# Altium project ESP32 HUST 01.PrjPcb
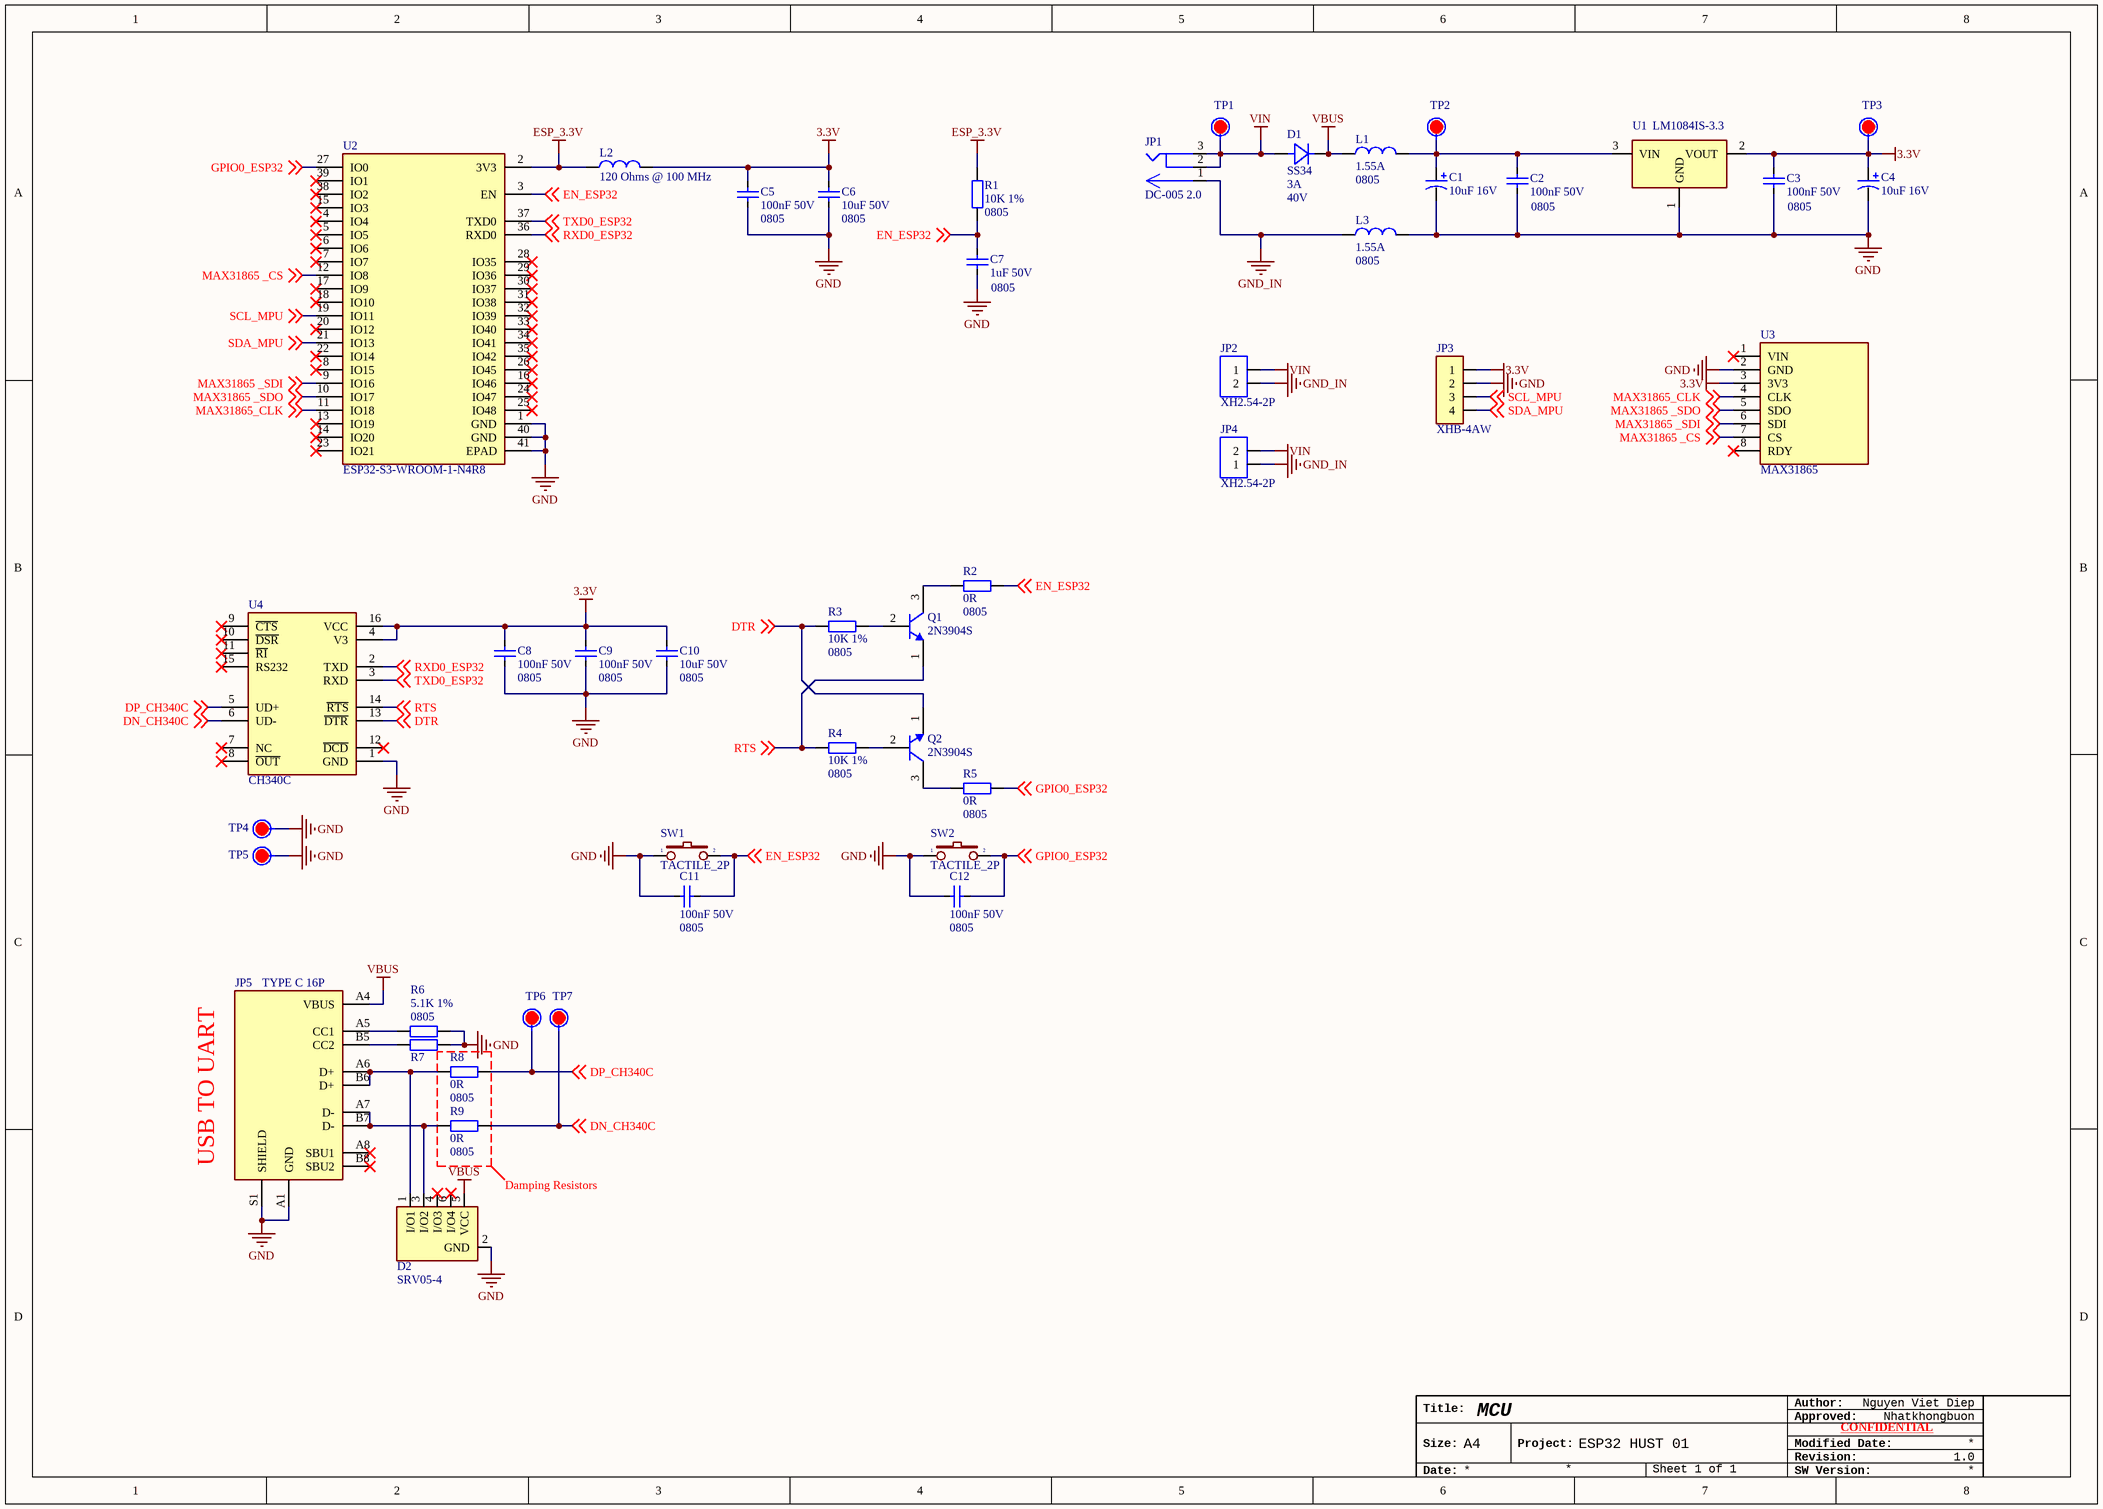
[diagram p0: MCU.SchDoc]
1 sheet, 46 parts. Net scope: global (net labels, ports and power ports of the same name join across sheets).
Board file: PCB.PcbDoc

## Sheet MCU.SchDoc: MCU
size A3; ApprovedBy: Nhatkhongbuon; Author: Nguyen Viet Diep; Revision: 1.0; SheetNumber: 1; SheetTotal: 1; ProjectTitle: ESP32 HUST 01

### Parts
C1  10uF 16V  [CAP-ALU-SMD-B -NEW]
C2  100nF 50V  Size: 0805  [CAP_SMD_0805_NEW]
C3  100nF 50V  Size: 0805  [CAP_SMD_0805_NEW]
C4  10uF 16V  [CAP-ALU-SMD-B -NEW]
C5  100nF 50V  Size: 0805  [CAP_SMD_0805_NEW]
C6  10uF 50V  Size: 0805  [CAP_SMD_0805_NEW]
C7  1uF 50V  Size: 0805  [CAP_SMD_0805_NEW]
C8  100nF 50V  Size: 0805  [CAP_SMD_0805_NEW]
C9  100nF 50V  Size: 0805  [CAP_SMD_0805_NEW]
C10  10uF 50V  Size: 0805  [CAP_SMD_0805_NEW]
C11  100nF 50V  Size: 0805  [CAP_SMD_0805_NEW]
C12  100nF 50V  Size: 0805  [CAP_SMD_0805_NEW]
D1  SS34  Current: 3A  DC Voltage: 40V  [SMA]
D2  SRV05-4  [SOT23-6]
JP1  DC-005 2.0  [DC_POWER_JACK]
JP2  XH2.54-2P  [XH_2.54_2P]
JP3  XHB-4AW  [CONN_XHB-4AW]
JP4  XH2.54-2P  [XH_2.54_2P]
JP5  TYPE C 16P  [TYPE C 16P]
L1  Current: 1.55A  Size: 0805  [FB_0805]  (hidden comment: 120Ohms 100Mhz)
L2  Impedance @ Frequency: 120 Ohms @ 100 MHz  [FB_0805]  (hidden comment: 120Ohms 100Mhz)
L3  Current: 1.55A  Size: 0805  [FB_0805]  (hidden comment: 120Ohms 100Mhz)
Q1  2N3904S  [2N3904S]
Q2  2N3904S  [2N3904S]
R1  10K 1%  Size: 0805  [RES_SMD_0805]
R2  0R  Size: 0805  [RES_SMD_0805]
R3  10K 1%  Size: 0805  [RES_SMD_0805]
R4  10K 1%  Size: 0805  [RES_SMD_0805]
R5  0R  Size: 0805  [RES_SMD_0805]
R6  5.1K 1%  Size: 0805  [RES_SMD_0805]
R7  5.1K 1%  [RES_SMD_0805]  (value not drawn)
R8  0R  Size: 0805  [RES_SMD_0805]
R9  0R  Size: 0805  [RES_SMD_0805]
SW1  TACTILE_2P  [C&K SW 2P]
SW2  TACTILE_2P  [C&K SW 2P]
TP1  Test Point  [TEST_POINT]  (value not drawn)
TP2  Test Point  [TEST_POINT]  (value not drawn)
TP3  Test Point  [TEST_POINT]  (value not drawn)
TP4  Test Point  [TEST_POINT]  (value not drawn)
TP5  Test Point  [TEST_POINT]  (value not drawn)
TP6  Test Point  [TEST_POINT]  (value not drawn)
TP7  Test Point  [TEST_POINT]  (value not drawn)
U1  LM1084IS-3.3  [TO263]
U2  ESP32-S3-WROOM-1-N4R8  [ESP32-S3-WROOM-1-N4R8]
U3  MAX31865  [MAX31865 - 3]
U4  CH340C  [CH340C]

### Nets
3.3V: C3.2 C4.1 C5.2 C6.2 C8.2 C9.2 C10.2 JP3.1 L2.2 TP3.1 U1.2(VOUT) U3.3(3V3) U4.4(V3) U4.16(VCC)
ESP_3.3V: L2.1 R1.2 U2.2(3V3)
GND: C1.2 C2.1 C3.1 C4.2 C5.1 C6.1 C7.1 C8.1 C9.1 C10.1 C11.2 C12.2 D2.2(GND) JP3.2 JP5.A1(GND) JP5.S1(SHIELD) L3.2 R6.2 R7.2 SW1.1 SW2.1 TP4.1 TP5.1 U1.1(GND) U2.1(GND) U2.40(GND) U2.41(EPAD) U3.2(GND) U4.1(GND)
GND_IN: JP1.1 JP2.2 JP4.1 L3.1
VBUS: D1.C D2.5(VCC) JP5.A4(VBUS) L1.1
VIN: D1.A JP1.2 JP1.3 JP2.1 JP4.2 TP1.1
DN_CH340C: R9.2 TP7.1 U4.6(UD-) ; off-sheet DN_CH340C
DP_CH340C: R8.2 TP6.1 U4.5(UD+) ; off-sheet DP_CH340C
DTR: Q2.1(B) R3.2 U4.13(~{DTR}) ; off-sheet DTR
EN_ESP32: C7.2 C11.1 R1.1 R2.2 SW1.2 U2.3(EN) ; off-sheet EN_ESP32
GPIO0_ESP32: C12.1 R5.2 SW2.2 U2.27(IO0) ; off-sheet GPIO0_ESP32
MAX31865 _CS: U2.12(IO8) U3.7(CS) ; off-sheet MAX31865 _CS
MAX31865 _SDI: U2.9(IO16) U3.6(SDI) ; off-sheet MAX31865 _SDI
MAX31865 _SDO: U2.10(IO17) U3.5(SDO) ; off-sheet MAX31865 _SDO
MAX31865_CLK: U2.11(IO18) U3.4(CLK) ; off-sheet MAX31865_CLK
RTS: Q1.1(B) R4.2 U4.14(~{RTS}) ; off-sheet RTS
RXD0_ESP32: U2.36(RXD0) U4.2(TXD) ; off-sheet RXD0_ESP32
SCL_MPU: JP3.3 U2.19(IO11) ; off-sheet SCL_MPU
SDA_MPU: JP3.4 U2.21(IO13) ; off-sheet SDA_MPU
TXD0_ESP32: U2.37(TXD0) U4.3(RXD) ; off-sheet TXD0_ESP32
NetC1_1: C1.1 C2.2 L1.2 TP2.1 U1.3(VIN)
NetD2_1: D2.1(I/O1) JP5.A6(D+) JP5.B6(D+) R8.1
NetD2_3: D2.3(I/O2) JP5.A7(D-) JP5.B7(D-) R9.1
NetJP5_A5: JP5.A5(CC1) R6.1
NetJP5_B5: JP5.B5(CC2) R7.1
NetQ1_2: Q1.2(E) R3.1
NetQ1_3: Q1.3(C) R2.1
NetQ2_2: Q2.2(E) R4.1
NetQ2_3: Q2.3(C) R5.1

Not connected (* = marked no-connect by the designer): D2 4(I/O3)* 6(I/O4)*; JP5 A8(SBU1)* B8(SBU2)*; U2 4(IO4)* 5(IO5)* 6(IO6)* 7(IO7)* 8(IO15)* 13(IO19)* 14(IO20)* 15(IO3)* 16(IO46)* 17(IO9)* 18(IO10)* 20(IO12)* 22(IO14)* 23(IO21)* 24(IO47)* 25(IO48)* 26(IO45)* 28(IO35)* 29(IO36)* 30(IO37)* 31(IO38)* 32(IO39)* 33(IO40)* 34(IO41)* 35(IO42)* 38(IO2)* 39(IO1)*; U3 1(VIN)* 8(RDY)*; U4 7(NC)* 8(~{OUT})* 9(~{CTS})* 10(~{DSR})* 11(~{RI})* 12(~{DCD})* 15(RS232)*

### Notes on the sheet
- (near JP5) USB TO UART
- (near D2) Damping Resistors
- Author:
- Title:
- Size:
- A4
- Project:
- Approved:
- Revision:
- Modified Date:
- CONFIDENTIAL
- Date:
- SW Version:
- (in symbol LM1084IS-3.3) /

### Library data of the parts
C1 C4 = C_ALU_10uF_16V_B: 10uF 16V 14mA@120Hz ±20% SMD,D4xL5.4mm Aluminum Electrolytic Capacitors - SMD ROHS; Manufacturer: KNSCHA; Manufacture Part Number: RST10UF16V013; Packaging: Cut Tape (CT); Link: https://www.lcsc.com/product-detail/Aluminum-Electrolytic-Capacitors-SMD_KNSCHA-RST10UF16V013_C4747968.html; Price: $0.0217; Size: B
C2 C3 C5 C8 C9 C11 C12 = C0805_MLCC_100nF_50V: 0.1 µF ±10% 50V Ceramic Capacitor X7R 0805 (2012 Metric); Manufacturer: YAGEO; Manufacture Part Number: CC0805KRX7R9BB104; Packaging: Cut Tape (CT); Link: https://www.digikey.cn/en/products/detail/yageo/CC0805KRX7R9BB104/302874; Price: $0.10
C6 C10 = C0805_MLCC_10uF_50V: 10 µF ±20% 50V Ceramic Capacitor X5R 0805 (2012 Metric); Manufacturer: Murata Electronics; Manufacture Part Number: GRM21BR61H106ME43L; Packaging: Cut Tape (CT); Link: https://www.digikey.cn/en/products/detail/murata-electronics/GRM21BR61H106ME43L/10326317; Price: $0.34
C7 = C0805_MLCC_1uF_50V: 1 µF ±10% 50V Ceramic Capacitor X7R 0805 (2012 Metric); Manufacturer: Samsung Electro-Mechanics; Manufacture Part Number: CL21B105KBFNNNG; Packaging: Cut Tape (CT); Link: https://www.digikey.cn/en/products/detail/samsung-electro-mechanics/CL21B105KBFNNNG/3894467; Price: $0.11
D1 = SS34: Diode 40 V 3A Surface Mount SMA; Manufacturer: MDD; Manufacture Part Number: SS34; Packaging: Cut Tape (CT); Link: https://www.digikey.cn/en/products/detail/nextgen-components/SS34/15911595; Price: $0.185
D2 = TVS_SRV05-4: 15V Clamp 4A (8/20µs) Ipp Tvs Diode Surface Mount SOT23-6L; Manufacturer: ANBON SEMICONDUCTOR (INT'L) LIMITED; Voltage - Reverse Standoff (Typ): 5V (Max); Voltage - Breakdown (Min): 6V; VNese Price: 3300; Manufacture Part Number: SRV05-4; Packaging: Cut Tape (CT); Link: https://www.digikey.com/en/products/detail/anbon-semiconductor-int-l-limited/srv05-4/21774371; Price: $ 0.10; Voltage - Clamping (Max) @ Ipp: 15V; Link Shopee: https://linhkien.cxt.vn/4592-cdsot23-srv05-4-tvs-diode-24v-40v-sot23-6.html
JP1 = DC-005 2.0: Right-Angle DC Power Receptacle 2mm 6.4mm Plugin DC Power Connector ROHS; Manufacturer: BOOMELE(Boom Precision Elec); Manufacture Part Number: DC-005 2.0; Link: https://www.lcsc.com/product-detail/DC-Power-Connector_BOOMELE-Boom-Precision-Elec-DC-005-2-0_C16214.html; Price: $ 0.0521
JP2 JP4 = XH2.54-2P: 1x2P 2P XH 1 2.54mm Tin 2 -25℃~+85℃ Brass 3A Straight Plugin,P=2.54mm Wire To Board Connector ROHS; Manufacturer: Megastar; Manufacture Part Number: ZX-XH2.54-2PZZ; Link: https://www.lcsc.com/product-detail/Wire-To-Board-Connector_Megastar-ZX-XH2-54-2PZZ_C7429632.html; Price: $ 0.005
JP3 = XHB-4AW: 1x4P 4P 1 2.5mm 4 Right-Angle Push-Pull,P=2.5mm Wire To Board Connector ROHS; Manufacturer: BOOMELE(Boom Precision Elec); Manufacture Part Number: XHB-4AW; Link: https://www.lcsc.com/product-detail/Wire-To-Board-Connector_BOOMELE-Boom-Precision-Elec-XHB-4AW_C95476.html; Price: $ 0.0230
JP5 = TYPE_C_16P: USB-C (USB TYPE-C) USB 2.0 Receptacle Connector 24 (16+8 Dummy) Position Surface Mount, Right Angle; Through Hole; Manufacturer: Amphenol ICC (Commercial Products); Manufacture Part Number: 12402012E212A; Packaging: Cut Tape; Link: https://www.digikey.cn/en/products/detail/amphenol-cs-commercial-products/12402012E212A/13683192; Price: $0.79
L1 L3 = FR_120Ohms_100Mhz: Manufacturer: Murata Electronics; Manufacture Part Number: BLM21PG121BH1D; Impedance @ Frequency: 120 Ohms @ 100 MHz; Packaging: Cut Tape (CT); Link: https://www.digikey.cn/en/products/detail/murata-electronics/BLM21PG121BH1D/10702696; Price: $0.18
L2 = FR_120Ohms_100Mhz: Manufacturer: Murata Electronics; Manufacture Part Number: BLM21PG121BH1D; Current: 1.55A; Packaging: Cut Tape (CT); Link: https://www.digikey.cn/en/products/detail/murata-electronics/BLM21PG121BH1D/10702696; Price: $0.18; Size: 0805
Q1 Q2 = 2N3904S-RTK/PS: 40V 350mW 100@10mA,1V 200mA NPN SOT-23 Bipolar (BJT) ROHS; Manufacturer: KEC Semicon; VNese Price: 400; Manufacture Part Number: 2N3904S-RTK/PS; Packaging: Cut Tape (CT); Link: https://www.lcsc.com/product-detail/Bipolar-BJT_KEC-Semicon-2N3904S-RTK-PS_C18536.html; Price: $ 0.28; Link Shopee: https://linhkienchatluong.vn/transistor/2n3904-mmbt3904-1am-npn-transistor-02a-40v-sot-23-chinh-hang-jcet_sp787_ct15946.aspx
R1 R3 R4 = R0805_10K: 10 kOhms ±1% 0.125W, 1/8W Chip Resistor 0805 (2012 Metric) Moisture Resistant Thick Film; Manufacturer: YAGEO; Manufacture Part Number: RC0805FR-0710KL; Packaging: Cut Tape (CT); Price: $0.10; Link: https://www.digikey.cn/en/products/detail/yageo/RC0805FR-0710KL/727535
R2 R5 R8 R9 = R0805_0R: 0 Ohms Jumper Chip Resistor 0805 (2012 Metric) Automotive AEC-Q200 Thick Film; Manufacturer: Vishay Dale; Manufacture Part Number: CRCW08050000Z0EA; Packaging: Cut Tape (CT); Link: https://www.digikey.cn/en/products/detail/vishay-dale/CRCW08050000Z0EA/1175125; Price: $0.10
R6 R7 = R0805_5.1K: 5.1 kOhms ±1% 0.125W, 1/8W Chip Resistor 0805 (2012 Metric) Moisture Resistant Thick Film; Manufacturer: YAGEO; Manufacture Part Number: RC0805FR-075K1L; Packaging: Cut Tape (CT); Link: https://www.digikey.com/en/products/detail/yageo/RC0805FR-075K1L/727988; Price: $0.10
  R7: Size: 0805
SW1 SW2 = SWITCH_TACTILE_SPST: Tactile Switch SPST-NO Top Actuated Surface Mount; Manufacturer: C&K; Manufacture Part Number: PTS636 SM25F SMTR LFS; Packaging: Cut Tape (CT); Link: https://www.digikey.cn/en/products/detail/c-k/PTS636-SM25F-SMTR-LFS/10071742?s=N4IgTCBcDaIAoBUDKA2AzCgBEgsmArAGLY4IBKmAMoUiALoC%2BQA; Price: $0.24
TP1-TP7 = TEST_POINT
U1 = LM1084IS-3.3: Linear Voltage Regulator IC Positive Fixed 1 Output 5A TO-263 (DDPAK-3); Manufacturer: STMicroelectronics; Manufacture Part Number: LM1084IS-3.3/NOPB; VNese Price: 7000; Packaging: Cut Tape (CT); Link: https://www.digikey.com/en/products/detail/texas-instruments/lm1084is-3-3-nopb/363551; Price: $2.66; Link Shopee: https://linhkienchatluong.vn/ic-on-ap/lm1084is-33-ic-on-ap-33v-5a-to-263-hgc-dong-day_sp1000_ct16043.aspx
U2 = ESP32-S3-WROOM-1-N4R8: Bluetooth, WiFi 802.11b/g/n, Bluetooth v5.0 Transceiver Module 2.4GHz PCB Trace Surface Mount; Manufacturer: Espressif Systems; VNese Price: 115000; Output Power: 20.5 dBm; Supply Voltage - Min: 3 V; Supply Voltage - Max: 3.6 V; Interface Type: I2C, I2S, SPI, PWM, UART, USB; Protocol - Bluetooth, BLE - 802.15.1: Bluetooth 5.0; Data Rate: 50 Mb/s; Manufacture Part Number: ESP32-S3-WROOM-1-N4R8; Packaging: Cut Tape (CT); Link: https://www.digikey.com/en/products/detail/espressif-systems/ESP32-S3-WROOM-1-N4R8/16162637?s=N4IgTCBcDaIKIGUAKBmMBaBL0HUBKA8gQLLoCM6AcgCx4AcIAugL5A; Price: $ 3.35; Link Shopee: https://linhkien.cxt.vn/9869-esp32-s3-wroom-1-n4r8-module-wifibluetooth.html; Frequency: 2.4 GHz; Minimum Operating Temperature: - 40 C; Maximum Operating Temperature: + 65 C; Antenna Connector Type: PCB; Protocol - WiFi - 802.11: WiFi
U3 = MAX31865: Mạch chuyển tín hiệu RTD to Digital MAX31865 PT100/PT1000; VNese Price: 100000; Link Shopee: https://hshop.vn/mach-chuyen-tin-hieu-rtd-to-digital-max31865-pt100-pt1000
U4 = CH340C: 2Mbps Transceiver USB 2.0 SOP-16 USB Converters ROHS; Manufacturer: WCH(Jiangsu Qin Heng); VNese Price: 10000; Manufacture Part Number: CH340C; Packaging: Cut Tape (CT); Link: https://www.lcsc.com/product-detail/USB-Converters_WCH-Jiangsu-Qin-Heng-CH340C_C84681.html; Price: $ 0.49; Link Shopee: https://linhkien.cxt.vn/4690-ch340c-ic-transceiver-2mbps-usb20-sop-16.html